# Altium schematic sheet norbi_lm_pl_dcr.SchDoc: Имя
size 209 x 297 mm; ApprovedBy: Утвердил; CheckedBy: Проверил; Author: Разработал; Organization: НГУ; DocumentNumber: Децимальный номер Э3; SheetNumber: Лист; SheetTotal: Листов; PageSetup: Record=PageOptions|CenterHorizontal=True|CenterVertical=True|PrintScale=1.00|XCorrection=1.00|YCorrection=1.00|PrintKind=1|BorderSize=5000000|LeftOffset=0|BottomOffset=0|Orientation=2|PaperLength=1000|PaperWidth=1000|Scale=100|PaperSource=15|PrintQuality=1200|MediaType=1|DitherType=10|PaperKind=A3|PrintScaleMode=1; Weight: -; ScaleFactor: -; NormInspection: Норм.Контр.
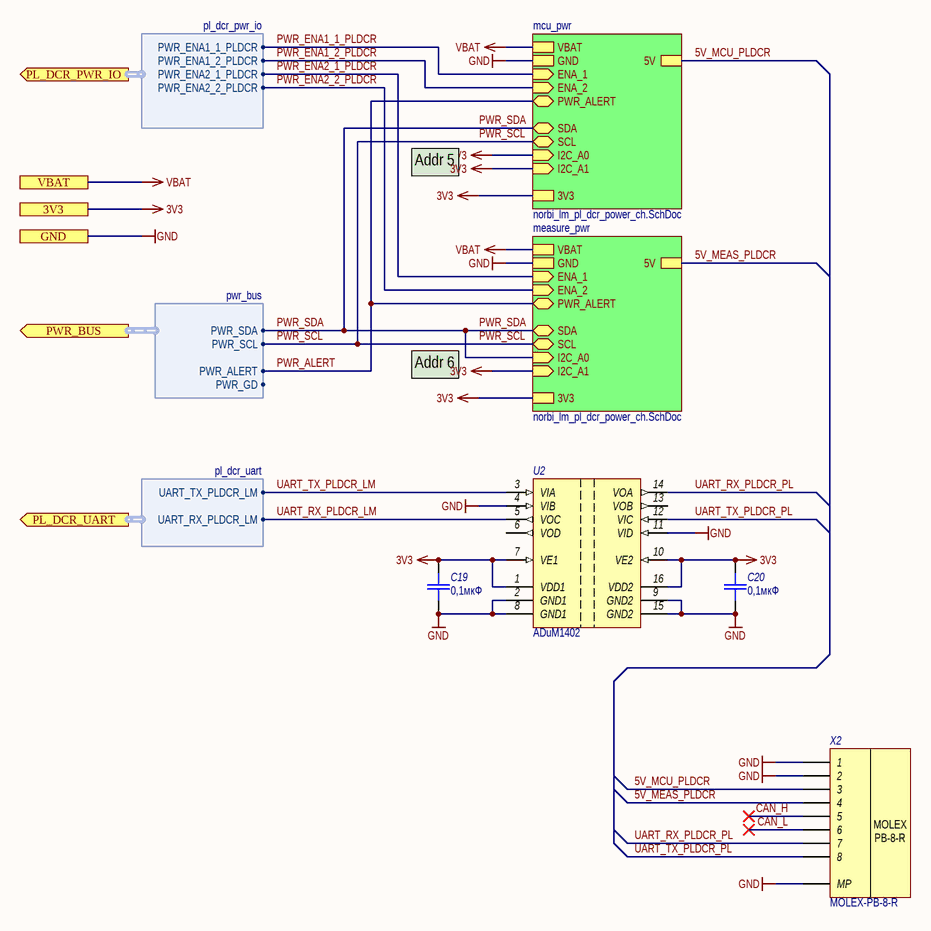
[diagram p0: norbi_lm_pl_dcr.SchDoc]

## Parts
C19  0,1мкФ  [CR-0805]
C20  0,1мкФ  [CR-0805]
U2  ADuM1402  [SOIC-16-WIDE]
X2  MOLEX-PB-8  [MOLEX-PB-8-R]  (value not drawn)

## Sub-sheets
mcu_pwr = norbi_lm_pl_dcr_power_ch.SchDoc: I2C_A1 (in), SCL (bidir), 5V, PWR_ALERT (bidir), SDA (bidir), I2C_A0 (in), VBAT, GND, 3V3, ENA_1 (in), ENA_2 (in)
measure_pwr = norbi_lm_pl_dcr_power_ch.SchDoc: I2C_A1 (in), SCL (bidir), 5V, PWR_ALERT (bidir), SDA (bidir), I2C_A0 (in), VBAT, GND, 3V3, ENA_1 (in), ENA_2 (in)

## Ports
3V3, GND, PL_DCR_PWR_IO (out, harness pl_dcr_pwr_io), PL_DCR_UART (out, harness pl_dcr_uart), PWR_BUS (out, harness pwr_bus), VBAT

## Harnesses
pl_dcr_uart: UART_TX_PLDCR_LM, UART_RX_PLDCR_LM
pwr_bus: PWR_SDA, PWR_SCL, PWR_ALERT, PWR_GD
pl_dcr_pwr_io: PWR_ENA1_1_PLDCR, PWR_ENA1_2_PLDCR, PWR_ENA2_1_PLDCR, PWR_ENA2_2_PLDCR

## Nets
3V3: C19.2 C20.2 U2.1(VDD1) U2.7(VE1) U2.10(VE2) U2.16(VDD2) ; port 3V3, sheet mcu_pwr/I2C_A1, sheet mcu_pwr/I2C_A0, sheet mcu_pwr/3V3, sheet measure_pwr/I2C_A1, sheet measure_pwr/3V3
GND: C19.1 C20.1 U2.2(GND1) U2.4(VIB) U2.8(GND1) U2.9(GND2) U2.11(VID) U2.15(GND2) X2.1 X2.2 X2.MP ; port GND, sheet mcu_pwr/GND, sheet measure_pwr/GND
VBAT: port VBAT, sheet mcu_pwr/VBAT, sheet measure_pwr/VBAT
5V_MCU_PLDCR: X2.3 ; sheet mcu_pwr/5V
5V_MEAS_PLDCR: X2.4 ; sheet measure_pwr/5V
CAN_H: X2.5
CAN_L: X2.6
PWR_ALERT: sheet mcu_pwr/PWR_ALERT, sheet measure_pwr/PWR_ALERT, port PWR_BUS.PWR_ALERT
PWR_ENA1_1_PLDCR: sheet mcu_pwr/ENA_1, port PL_DCR_PWR_IO.PWR_ENA1_1_PLDCR
PWR_ENA1_2_PLDCR: sheet mcu_pwr/ENA_2, port PL_DCR_PWR_IO.PWR_ENA1_2_PLDCR
PWR_ENA2_1_PLDCR: sheet measure_pwr/ENA_1, port PL_DCR_PWR_IO.PWR_ENA2_1_PLDCR
PWR_ENA2_2_PLDCR: sheet measure_pwr/ENA_2, port PL_DCR_PWR_IO.PWR_ENA2_2_PLDCR
PWR_SCL: sheet mcu_pwr/SCL, sheet measure_pwr/SCL, port PWR_BUS.PWR_SCL
PWR_SDA: sheet mcu_pwr/SDA, sheet measure_pwr/SDA, sheet measure_pwr/I2C_A0, port PWR_BUS.PWR_SDA
UART_RX_PLDCR_LM: U2.5(VOC) ; port PL_DCR_UART.UART_RX_PLDCR_LM
UART_RX_PLDCR_PL: U2.14(VOA) X2.7
UART_TX_PLDCR_LM: U2.3(VIA) ; port PL_DCR_UART.UART_TX_PLDCR_LM
UART_TX_PLDCR_PL: U2.12(VIC) X2.8

Not connected (* = marked no-connect by the designer): U2 6(VOD) 13(VOB)

## Notes on the sheet
- Addr 5
- Addr 6
- Подп. и дата
- Инв. № дубл.
- Взам. инв. №
- Инв. № подл.
- Изм.
- Лист
- № докум.
- Подп.
- Дата
- Форма 2а ГОСТ 2.104-2006
- Копировал
- Формат А4
- (in symbol MOLEX-PB-8) MOLEX / PB-8-R

## Library data of the parts
C19 C20 = C_smd: Конденсатор для поверхностного монтажа; Назначение: Чип-конденсатор; Потребление, Вт: 0; Наименование: SMD-0603; Value: 0,1мкФ
U2 = ADuM1402: Quad Channel Digital Isolator, 2.5 KV rms Insulation Rating; Назначение: 4-канальный цифровой изолятор; Потребление, Вт: 0,025; Наименование: ADuM1402
X2 = MOLEX-PB-8: MOLEX PicoBlade 8-pin; Назначение: MOLEX PicoBlade 8-pin to board; Потребление, Вт: 0,001; Наименование: MOLEX-PB-8-R